# Altium project ImuAnybus.PrjPcb
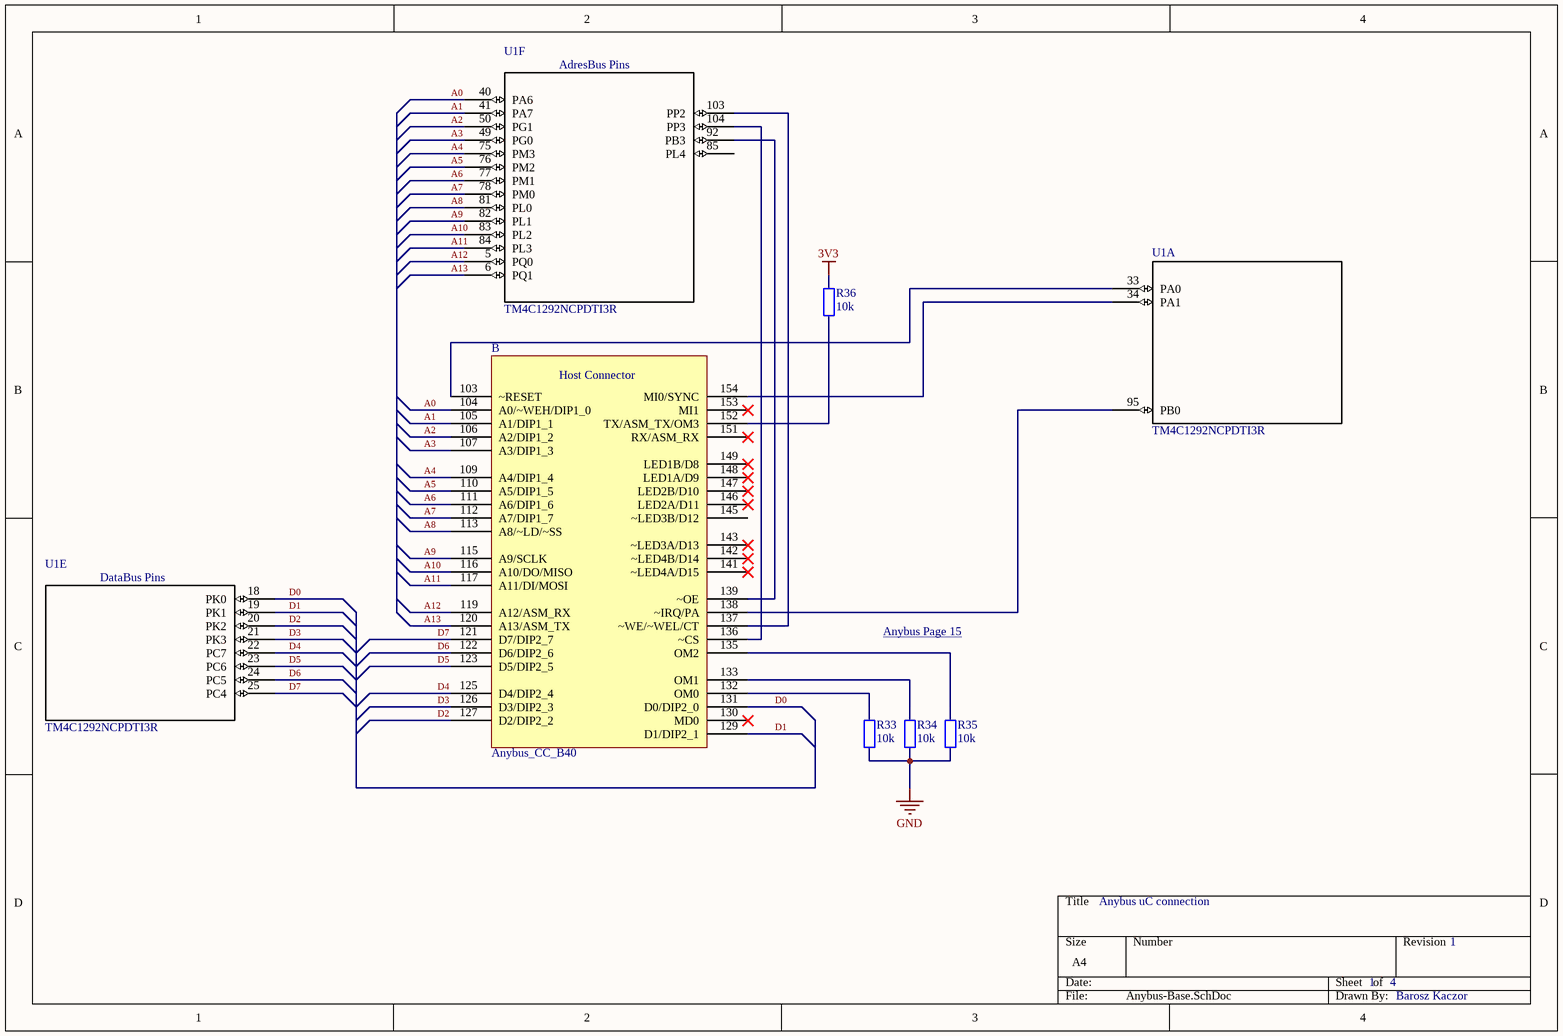
[diagram p0: Anybus-Base.SchDoc]
4 sheets, 73 parts. Net scope: global (net labels, ports and power ports of the same name join across sheets).
Board file: MainBoard.PcbDoc
Sheets:
  Anybus-Base.SchDoc
  PowerSupply.SchDoc
  Network.SchDoc
  Connectors.SchDoc

## Sheet Anybus-Base.SchDoc
size A4

### Parts
(Parts that share a designator on the sheet are numbered #1, #2 ... from top to bottom, then left to right.)
?#1  Anybus_CC_B40  [Anybus-CC-B40]  (part B of 3)
R33  10k  [0603_R HighDensity]
R34  10k  [0603_R HighDensity]
R35  10k  [0603_R HighDensity]
R36  10k  [RES0603_M]
U1  TM4C1292NCPDTI3R  [PDT0128A_N]  (parts A,E,F of 7)

### Nets
3V3: R36.2
GND: R33.1 R34.1 R35.1
A0: ?#1.104(A0/~WEH/DIP1_0) U1.40(PA6)
A1: ?#1.105(A1/DIP1_1) U1.41(PA7)
A2: ?#1.106(A2/DIP1_2) U1.50(PG1)
A3: ?#1.107(A3/DIP1_3) U1.49(PG0)
A4: ?#1.109(A4/DIP1_4) U1.75(PM3)
A5: ?#1.110(A5/DIP1_5) U1.76(PM2)
A6: ?#1.111(A6/DIP1_6) U1.77(PM1)
A7: ?#1.112(A7/DIP1_7) U1.78(PM0)
A8: ?#1.113(A8/~LD/~SS) U1.81(PL0)
A9: ?#1.115(A9/SCLK) U1.82(PL1)
A10: ?#1.116(A10/DO/MISO) U1.83(PL2)
A11: ?#1.117(A11/DI/MOSI) U1.84(PL3)
A12: ?#1.119(A12/ASM_RX) U1.5(PQ0)
A13: ?#1.120(A13/ASM_TX) U1.6(PQ1)
D0: ?#1.131(D0/DIP2_0) U1.18(PK0)
D1: ?#1.129(D1/DIP2_1) U1.19(PK1)
D2: ?#1.127(D2/DIP2_2) U1.20(PK2)
D3: ?#1.126(D3/DIP2_3) U1.21(PK3)
D4: ?#1.125(D4/DIP2_4) U1.22(PC7)
D5: ?#1.123(D5/DIP2_5) U1.23(PC6)
D6: ?#1.122(D6/DIP2_6) U1.24(PC5)
D7: ?#1.121(D7/DIP2_7) U1.25(PC4)
Net?#1_103: ?#1.103(~RESET) U1.33(PA0)
Net?#1_132: ?#1.132(OM0) R33.2
Net?#1_133: ?#1.133(OM1) R34.2
Net?#1_135: ?#1.135(OM2) R35.2
Net?#1_136: ?#1.136(~CS) U1.104(PP3)
Net?#1_137: ?#1.137(~WE/~WEL/CT) U1.103(PP2)
Net?#1_138: ?#1.138(~IRQ/PA) U1.95(PB0)
Net?#1_139: ?#1.139(~OE) U1.92(PB3)
Net?#1_152: ?#1.152(TX/ASM_TX/OM3) R36.1
Net?#1_154: ?#1.154(MI0/SYNC) U1.34(PA1)

Not connected (* = marked no-connect by the designer): ?#1 130(MD0)* 141(~LED4A/D15)* 142(~LED4B/D14)* 143(~LED3A/D13)* 145(~LED3B/D12) 146(LED2A/D11)* 147(LED2B/D10)* 148(LED1A/D9)* 149(LED1B/D8)* 151(RX/ASM_RX)* 153(MI1)*; U1 85(PL4)

### Notes on the sheet
- Anybus Page 15 <http://www.anybus.com/upload/Anybus-CompactCom%20B40%20Brick-2237-Anybus%20CompactCom%20M40%20Hardware%20Design%20Guide.pdf>
- Anybus uC connection
- 1     4
- 1
- Barosz Kaczor
- (in symbol Anybus_CC_B40, part B) Host Connector
- (in symbol TM4C1292NCPDTI3R, part E) DataBus Pins
- (in symbol TM4C1292NCPDTI3R, part F) AdresBus Pins

### Library data of the parts
R33-R36 = R: Resistor
U1 = TM4C1292NCPDTI3R: Imported; Manufacturer: Texas Instruments; CompType: IC; PIN_COUNT: 128; Application_BuildNumber: *; PartNumber: TM4C1292NCPDTI3R; Alternate PartNumber: TM4C1292NCPDTI3; PackageReference: PDT0128A; MountType: SMT; RoHS: Y; RefDes: RefDes; Type: DEV; Value: Value

## Sheet PowerSupply.SchDoc
size A4
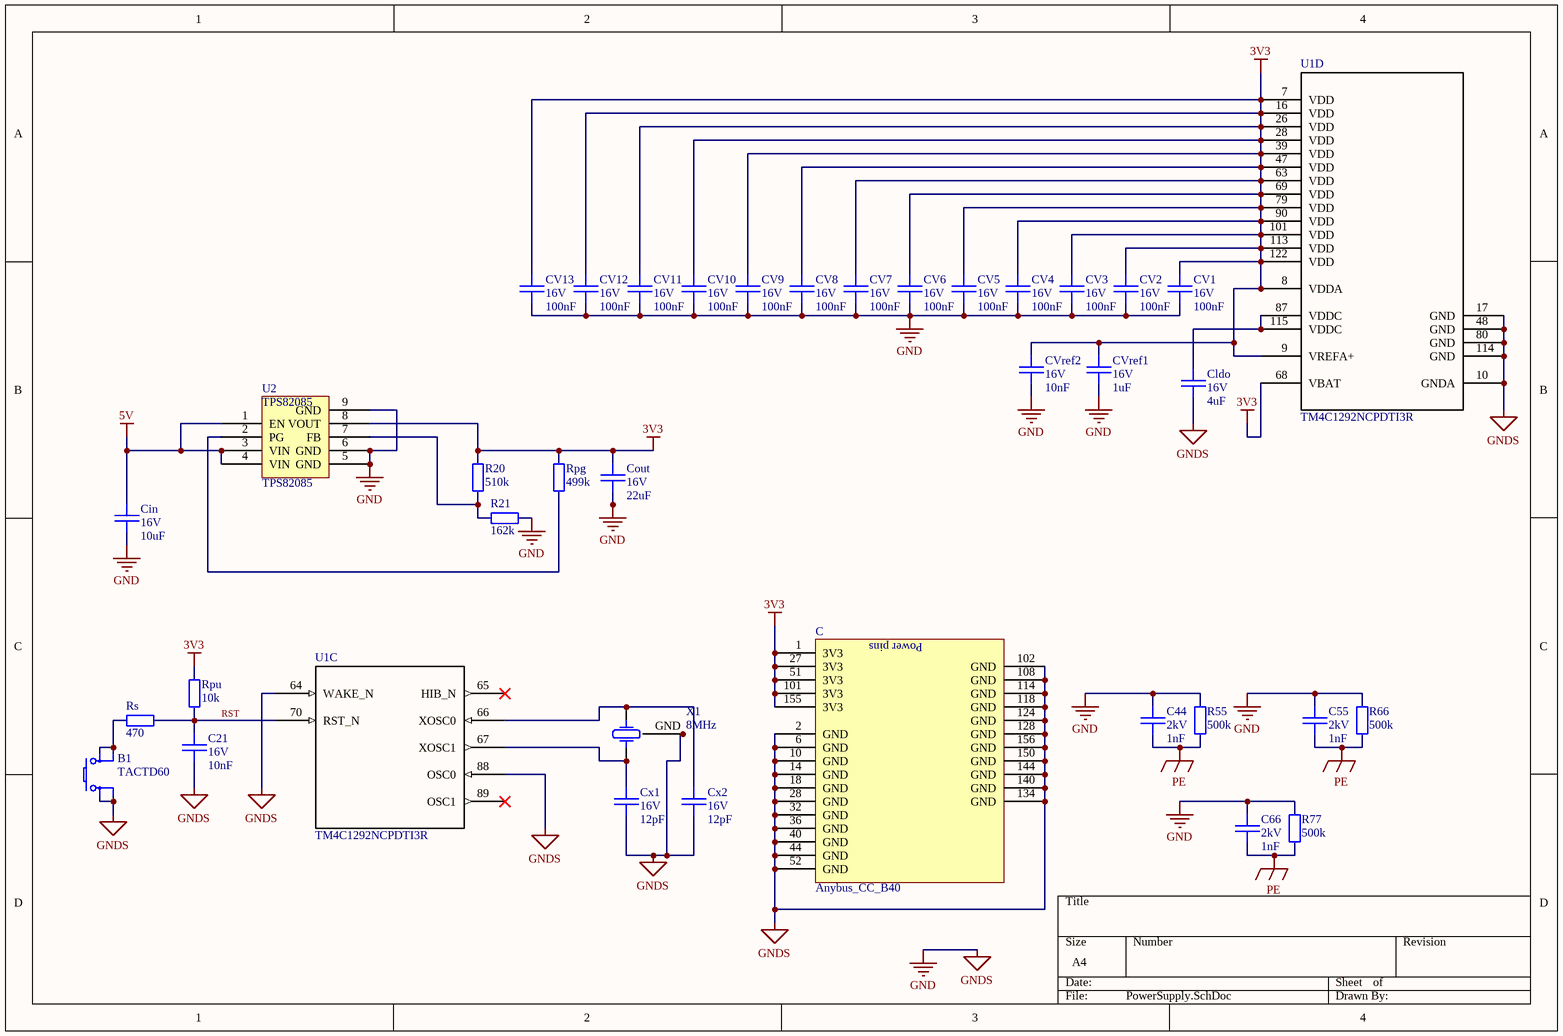
[diagram p1: PowerSupply.SchDoc]

### Parts
B1  Symbol: TACTD60  [_B_TACTD50]  (hidden comment: B_TACTD60)
C21  value 10nF  Voltage: 16V  [0603 HighDensity]  (hidden comment: 100n)
C44  value 1nF  Voltage: 2kV  [0603 HighDensity]  (hidden comment: 100n)
C55  value 1nF  Voltage: 2kV  [0603 HighDensity]  (hidden comment: 100n)
C66  value 1nF  Voltage: 2kV  [0603 HighDensity]  (hidden comment: 100n)
Cin  value 10uF  Voltage: 16V  [0603 HighDensity]  (hidden comment: 100n)
Cldo  value 4uF  Voltage: 16V  [0603 HighDensity]  (hidden comment: 100n)
Cout  value 22uF  Voltage: 16V  [0603 HighDensity]  (hidden comment: 100n)
CV1  value 100nF  Voltage: 16V  [0603 HighDensity]  (hidden comment: 100n)
CV2  value 100nF  Voltage: 16V  [0603 HighDensity]  (hidden comment: 100n)
CV3  value 100nF  Voltage: 16V  [0603 HighDensity]  (hidden comment: 100n)
CV4  value 100nF  Voltage: 16V  [0603 HighDensity]  (hidden comment: 100n)
CV5  value 100nF  Voltage: 16V  [0603 HighDensity]  (hidden comment: 100n)
CV6  value 100nF  Voltage: 16V  [0603 HighDensity]  (hidden comment: 100n)
CV7  value 100nF  Voltage: 16V  [0603 HighDensity]  (hidden comment: 100n)
CV8  value 100nF  Voltage: 16V  [0603 HighDensity]  (hidden comment: 100n)
CV9  value 100nF  Voltage: 16V  [0603 HighDensity]  (hidden comment: 100n)
CV10  value 100nF  Voltage: 16V  [0603 HighDensity]  (hidden comment: 100n)
CV11  value 100nF  Voltage: 16V  [0603 HighDensity]  (hidden comment: 100n)
CV12  value 100nF  Voltage: 16V  [0603 HighDensity]  (hidden comment: 100n)
CV13  value 100nF  Voltage: 16V  [0603 HighDensity]  (hidden comment: 100n)
CVref1  value 1uF  Voltage: 16V  [0603 HighDensity]  (hidden comment: 100n)
CVref2  value 10nF  Voltage: 16V  [0603 HighDensity]  (hidden comment: 100n)
Cx1  value 12pF  Voltage: 16V  [0603 HighDensity]  (hidden comment: 100n)
Cx2  value 12pF  Voltage: 16V  [0603 HighDensity]  (hidden comment: 100n)
R20  510k  [0603_R HighDensity]
R21  162k  [0603_R HighDensity]
R55  500k  [0603_R HighDensity]
R66  500k  [0603_R HighDensity]
R77  500k  [0603_R HighDensity]
Rpg  499k  [0603_R HighDensity]
Rpu  10k  [0603_R HighDensity]
Rs  470  [0603_R HighDensity]
U1  TM4C1292NCPDTI3R  [PDT0128A_N]  (parts C,D of 7)
U2  TPS82085  [uSIP-8]
X1  8MHz  [_X_ CFPX-180]
  Anybus_CC_B40  [Anybus-CC-B40]  (part C of 3)

### Nets
3V3: Cout.1 CV1.1 CV2.1 CV3.1 CV4.1 CV5.1 CV6.1 CV7.1 CV8.1 CV9.1 CV10.1 CV11.1 CV12.1 CV13.1 CVref1.1 CVref2.1 R20.2 Rpg.2 Rpu.2 U1.7(VDD) U1.8(VDDA) U1.9(VREFA+) U1.16(VDD) U1.26(VDD) U1.28(VDD) U1.39(VDD) U1.47(VDD) U1.63(VDD) U1.68(VBAT) U1.69(VDD) U1.79(VDD) U1.90(VDD) U1.101(VDD) U1.113(VDD) U1.122(VDD) U2.8(VOUT) .1(3V3) .27(3V3) .51(3V3) .101(3V3) .155(3V3)
5V: Cin.1 U2.1(EN) U2.3(VIN) U2.4(VIN)
GND: B1.1 B1.2 C21.2 C44.1 C55.1 C66.1 Cin.2 Cldo.2 Cout.2 CV1.2 CV2.2 CV3.2 CV4.2 CV5.2 CV6.2 CV7.2 CV8.2 CV9.2 CV10.2 CV11.2 CV12.2 CV13.2 CVref1.2 CVref2.2 Cx1.2 Cx2.2 R21.1 R55.2 R66.2 R77.2 U1.10(GNDA) U1.17(GND) U1.48(GND) U1.64(WAKE_N) U1.80(GND) U1.88(OSC0) U1.114(GND) U2.5(GND) U2.6(GND) U2.9(GND) X1.GND X1.GND2(GND) .2(GND) .6(GND) .10(GND) .14(GND) .18(GND) .28(GND) .32(GND) .36(GND) .40(GND) .44(GND) .52(GND) .102(GND) .108(GND) .114(GND) .118(GND) .124(GND) .128(GND) .134(GND) .140(GND) .144(GND) .150(GND) .156(GND)  [also labelled GNDS]
PE: C44.2 C55.2 C66.2 R55.1 R66.1 R77.1
RST: C21.1 Rpu.1 Rs.2 U1.70(RST_N)
NetB1_3: B1.3 B1.4 Rs.1
NetCldo_1: Cldo.1 U1.87(VDDC) U1.115(VDDC)
NetCx1_1: Cx1.1 U1.67(XOSC1) X1.1
NetCx2_1: Cx2.1 U1.66(XOSC0) X1.2
NetR20_1: R20.1 R21.2 U2.7(FB)
NetRpg_1: Rpg.1 U2.2(PG)

Not connected (* = marked no-connect by the designer): U1 65(HIB_N)* 89(OSC1)*

### Notes on the sheet
- (in symbol Anybus_CC_B40, part C) Power pins

### Library data of the parts
B1 = B_TACTD60: Tactile Switch 50mA/12VDC 6x6mm; Supplier: Maritex
C21 C44 C55 C66 Cin Cldo Cout CV1-CV13 CVref1 CVref2 Cx1 Cx2 = C_CER: Ceramic Capacitor
R20 R21 R55 R66 R77 Rpg Rpu Rs = R: Resistor
U1 = TM4C1292NCPDTI3R: as U1 on sheet Anybus-Base; Application_BuildNumber: *; PartNumber: TM4C1292NCPDTI3R; Alternate PartNumber: TM4C1292NCPDTI3; PackageReference: PDT0128A; MountType: SMT; RoHS: Y; RefDes: RefDes; Type: DEV; Value: Value
U2 = TPS82085: 3-A, 0.8-6-V, Step-Down DC/DC Converter
X1 = CFPX180: Crystal Oscillator; pin to pad: 2>3 GND>2 GND2>4

## Sheet Network.SchDoc
size A4
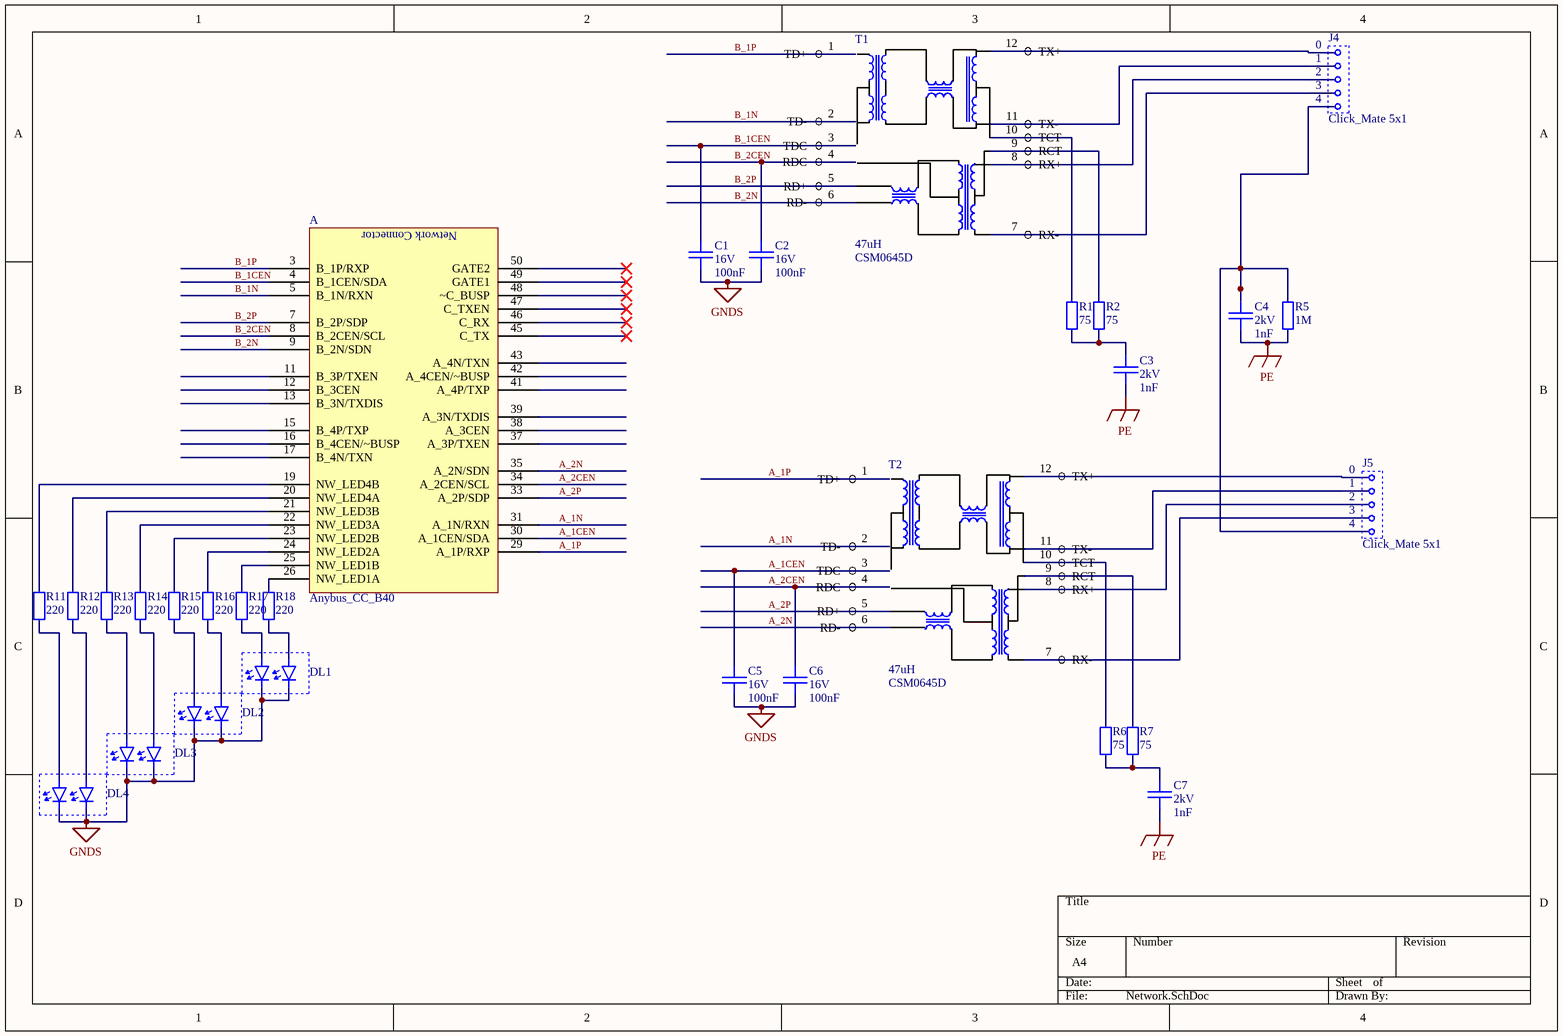
[diagram p2: Network.SchDoc]

### Parts
(Parts that share a designator on the sheet are numbered #1, #2 ... from top to bottom, then left to right.)
?#2  Anybus_CC_B40  [Anybus-CC-B40]  (part A of 3)
C1  value 100nF  Voltage: 16V  [0603 HighDensity]  (hidden comment: 100n)
C2  value 100nF  Voltage: 16V  [0603 HighDensity]  (hidden comment: 100n)
C3  value 1nF  Voltage: 2kV  [0603 HighDensity]  (hidden comment: 100n)
C4  value 1nF  Voltage: 2kV  [0603 HighDensity]  (hidden comment: 100n)
C5  value 100nF  Voltage: 16V  [0603 HighDensity]  (hidden comment: 100n)
C6  value 100nF  Voltage: 16V  [0603 HighDensity]  (hidden comment: 100n)
C7  value 1nF  Voltage: 2kV  [0603 HighDensity]  (hidden comment: 100n)
DL1  LED2  [2D-  3528, PLCC4]  (value not drawn)
DL2  LED2  [2D-  3528, PLCC4]  (value not drawn)
DL3  LED2  [2D-  3528, PLCC4]  (value not drawn)
DL4  LED2  [2D-  3528, PLCC4]  (value not drawn)
J4  Click_Mate 5x1  [CLIK-Mate 5x1]
J5  Click_Mate 5x1  [CLIK-Mate 5x1]
R1  75  [0603_R HighDensity]
R2  75  [0603_R HighDensity]
R5  1M  [0603_R HighDensity]
R6  75  [0603_R HighDensity]
R7  75  [0603_R HighDensity]
R11  220  [0603_R HighDensity]
R12  220  [0603_R HighDensity]
R13  220  [0603_R HighDensity]
R14  220  [0603_R HighDensity]
R15  220  [0603_R HighDensity]
R16  220  [0603_R HighDensity]
R17  220  [0603_R HighDensity]
R18  220  [0603_R HighDensity]
T1  47uH  Symbol: CSM0645D  [H1112]
T2  47uH  Symbol: CSM0645D  [H1112]

### Nets
GNDS: C1.2 C2.2 C5.2 C6.2 DL1.1 DL1.3 DL2.1 DL2.3 DL3.1 DL3.3 DL4.1 DL4.3  [project net GND]
PE: C3.2 C4.2 C7.2 R5.1
A_1CEN: ?#2.30(A_1CEN/SDA) C5.1 T2.3(TDC)
A_1N: ?#2.31(A_1N/RXN) T2.2(TD-)
A_1P: ?#2.29(A_1P/RXP) T2.1(TD+)
A_2CEN: ?#2.34(A_2CEN/SCL) C6.1 T2.4(RDC)
A_2N: ?#2.35(A_2N/SDN) T2.6(RD-)
A_2P: ?#2.33(A_2P/SDP) T2.5(RD+)
B_1CEN: ?#2.4(B_1CEN/SDA) C1.1 T1.3(TDC)
B_1N: ?#2.5(B_1N/RXN) T1.2(TD-)
B_1P: ?#2.3(B_1P/RXP) T1.1(TD+)
B_2CEN: ?#2.8(B_2CEN/SCL) C2.1 T1.4(RDC)
B_2N: ?#2.9(B_2N/SDN) T1.6(RD-)
B_2P: ?#2.7(B_2P/SDP) T1.5(RD+)
Net?#2_19: ?#2.19(NW_LED4B) R11.2
Net?#2_20: ?#2.20(NW_LED4A) R12.2
Net?#2_21: ?#2.21(NW_LED3B) R13.2
Net?#2_22: ?#2.22(NW_LED3A) R14.2
Net?#2_23: ?#2.23(NW_LED2B) R15.2
Net?#2_24: ?#2.24(NW_LED2A) R16.2
Net?#2_25: ?#2.25(NW_LED1B) R17.2
Net?#2_26: ?#2.26(NW_LED1A) R18.2
NetC3_1: C3.1 R1.1 R2.1
NetC4_1: C4.1 J4.4 J5.4 R5.2
NetC7_1: C7.1 R6.1 R7.1
NetDL1_2: DL1.2 R17.1
NetDL1_4: DL1.4 R18.1
NetDL2_2: DL2.2 R15.1
NetDL2_4: DL2.4 R16.1
NetDL3_2: DL3.2 R13.1
NetDL3_4: DL3.4 R14.1
NetDL4_2: DL4.2 R11.1
NetDL4_4: DL4.4 R12.1
NetJ4_0: J4.0 T1.12(TX+)
NetJ4_1: J4.1 T1.11(TX-)
NetJ4_2: J4.2 T1.8(RX+)
NetJ4_3: J4.3 T1.7(RX-)
NetJ5_0: J5.0 T2.12(TX+)
NetJ5_1: J5.1 T2.11(TX-)
NetJ5_2: J5.2 T2.8(RX+)
NetJ5_3: J5.3 T2.7(RX-)
NetR1_2: R1.2 T1.10(TCT)
NetR2_2: R2.2 T1.9(RCT)
NetR6_2: R6.2 T2.10(TCT)
NetR7_2: R7.2 T2.9(RCT)

Not connected (* = marked no-connect by the designer): ?#2 11(B_3P/TXEN) 12(B_3CEN) 13(B_3N/TXDIS) 15(B_4P/TXP) 16(B_4CEN/~BUSP) 17(B_4N/TXN) 37(A_3P/TXEN) 38(A_3CEN) 39(A_3N/TXDIS) 41(A_4P/TXP) 42(A_4CEN/~BUSP) 43(A_4N/TXN) 45(C_TX)* 46(C_RX)* 47(C_TXEN)* 48(~C_BUSP)* 49(GATE1)* 50(GATE2)*

### Notes on the sheet
- (in symbol Anybus_CC_B40, part A) Network Connector

### Library data of the parts
C1-C7 = C_CER: Ceramic Capacitor
DL1-DL4 = LED2: Light Emitting Diode - Double
R1 R2 R5-R7 R11-R18 = R: Resistor
T1 T2 = H1112-NL-TRANSFORMER: Power Inductor; Supplier: Maritex

## Sheet Connectors.SchDoc
size A4
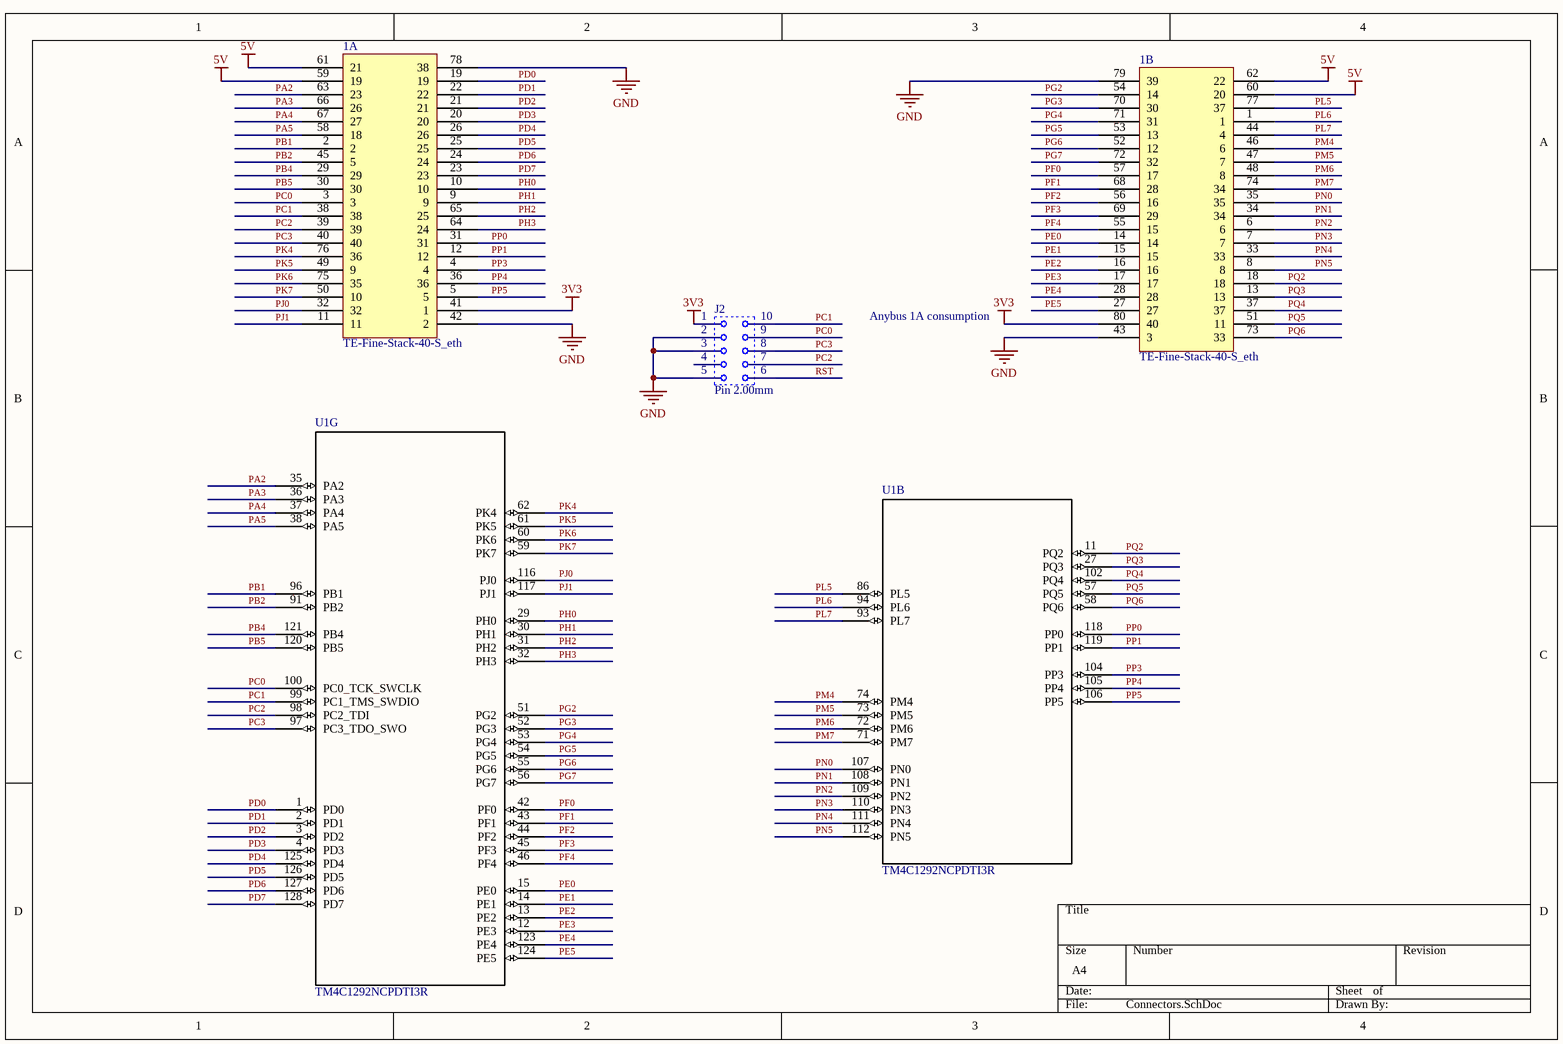
[diagram p3: Connectors.SchDoc]

### Parts
1  TE-Fine-Stack-40-S_eth  [TE-FINE-STACK-40-S-Eth]  (parts A,B of 2)
J2  Pin 2.00mm  [GOLDPIN 1.27MM SOCKET 2X5 SMD]
U1  TM4C1292NCPDTI3R  [PDT0128A_N]  (parts B,G of 7)

### Nets
3V3: 1.41(1) 1.80(40) J2.1
5V: 1.59(19) 1.60(20) 1.61(21) 1.62(22)
GND: 1.42(2) 1.43(3) 1.78(38) 1.79(39) J2.2 J2.3 J2.5
PA2: 1.63(23) U1.35(PA2)
PA3: 1.66(26) U1.36(PA3)
PA4: 1.67(27) U1.37(PA4)
PA5: 1.58(18) U1.38(PA5)
PB1: 1.2 U1.96(PB1)
PB2: 1.45(5) U1.91(PB2)
PB4: 1.29 U1.121(PB4)
PB5: 1.30 U1.120(PB5)
PC0: 1.3 J2.9 U1.100(PC0_TCK_SWCLK)
PC1: 1.38 J2.10 U1.99(PC1_TMS_SWDIO)
PC2: 1.39 J2.7 U1.98(PC2_TDI)
PC3: 1.40 J2.8 U1.97(PC3_TDO_SWO)
PD0: 1.19 U1.1(PD0)
PD1: 1.22 U1.2(PD1)
PD2: 1.21 U1.3(PD2)
PD3: 1.20 U1.4(PD3)
PD4: 1.26 U1.125(PD4)
PD5: 1.25 U1.126(PD5)
PD6: 1.24 U1.127(PD6)
PD7: 1.23 U1.128(PD7)
PE0: 1.14 U1.15(PE0)
PE1: 1.15 U1.14(PE1)
PE2: 1.16 U1.13(PE2)
PE3: 1.17 U1.12(PE3)
PE4: 1.28 U1.123(PE4)
PE5: 1.27 U1.124(PE5)
PF0: 1.57(17) U1.42(PF0)
PF1: 1.68(28) U1.43(PF1)
PF2: 1.56(16) U1.44(PF2)
PF3: 1.69(29) U1.45(PF3)
PF4: 1.55(15) U1.46(PF4)
PG2: 1.54(14) U1.51(PG2)
PG3: 1.70(30) U1.52(PG3)
PG4: 1.71(31) U1.53(PG4)
PG5: 1.53(13) U1.54(PG5)
PG6: 1.52(12) U1.55(PG6)
PG7: 1.72(32) U1.56(PG7)
PH0: 1.10 U1.29(PH0)
PH1: 1.9 U1.30(PH1)
PH2: 1.65(25) U1.31(PH2)
PH3: 1.64(24) U1.32(PH3)
PJ0: 1.32 U1.116(PJ0)
PJ1: 1.11 U1.117(PJ1)
PK4: 1.76(36) U1.62(PK4)
PK5: 1.49(9) U1.61(PK5)
PK6: 1.75(35) U1.60(PK6)
PK7: 1.50(10) U1.59(PK7)
PL5: 1.77(37) U1.86(PL5)
PL6: 1.1 U1.94(PL6)
PL7: 1.44(4) U1.93(PL7)
PM4: 1.46(6) U1.74(PM4)
PM5: 1.47(7) U1.73(PM5)
PM6: 1.48(8) U1.72(PM6)
PM7: 1.74(34) U1.71(PM7)
PN0: 1.35 U1.107(PN0)
PN1: 1.34 U1.108(PN1)
PN2: 1.6 U1.109(PN2)
PN3: 1.7 U1.110(PN3)
PN4: 1.33 U1.111(PN4)
PN5: 1.8 U1.112(PN5)
PP0: 1.31 U1.118(PP0)
PP1: 1.12 U1.119(PP1)
PP3: 1.4 U1.104(PP3)
PP4: 1.36 U1.105(PP4)
PP5: 1.5 U1.106(PP5)
PQ2: 1.18 U1.11(PQ2)
PQ3: 1.13 U1.27(PQ3)
PQ4: 1.37 U1.102(PQ4)
PQ5: 1.51(11) U1.57(PQ5)
PQ6: 1.73(33) U1.58(PQ6)
RST: J2.6

Not connected (* = marked no-connect by the designer): J2 4

### Notes on the sheet
- Anybus 1A consumption

### Library data of the parts
J2 = Goldpin 1.27 socket 2x5: Symbol: NINIGI ZL265-16DG; URL: http://www.tme.eu/pl/details/zl265-16dg/listwy-i-gniazda-kolkowe/ninigi/#; Supplier: TME
U1 = TM4C1292NCPDTI3R: as U1 on sheet Anybus-Base; Application_BuildNumber: *; PartNumber: TM4C1292NCPDTI3R; Alternate PartNumber: TM4C1292NCPDTI3; PackageReference: PDT0128A; MountType: SMT; RoHS: Y; RefDes: RefDes; Type: DEV; Value: Value

## Nets that join several sheets
3V3: Anybus-Base (R36.2), PowerSupply (41 pins), Connectors (1.41 1.80 J2.1)
5V: PowerSupply (Cin.1 U2.1 U2.3 U2.4), Connectors (1.59 1.60 1.61 1.62)
GND: Anybus-Base (R33.1 R34.1 R35.1), PowerSupply (64 pins), Network (12 pins), Connectors (7 pins)
PE: PowerSupply (6 pins), Network (C3.2 C4.2 C7.2 R5.1)
RST: PowerSupply (C21.1 Rpu.1 Rs.2 U1.70), Connectors (J2.6)